# Altium schematic sheet RF_433MHz.SchDoc
size A3
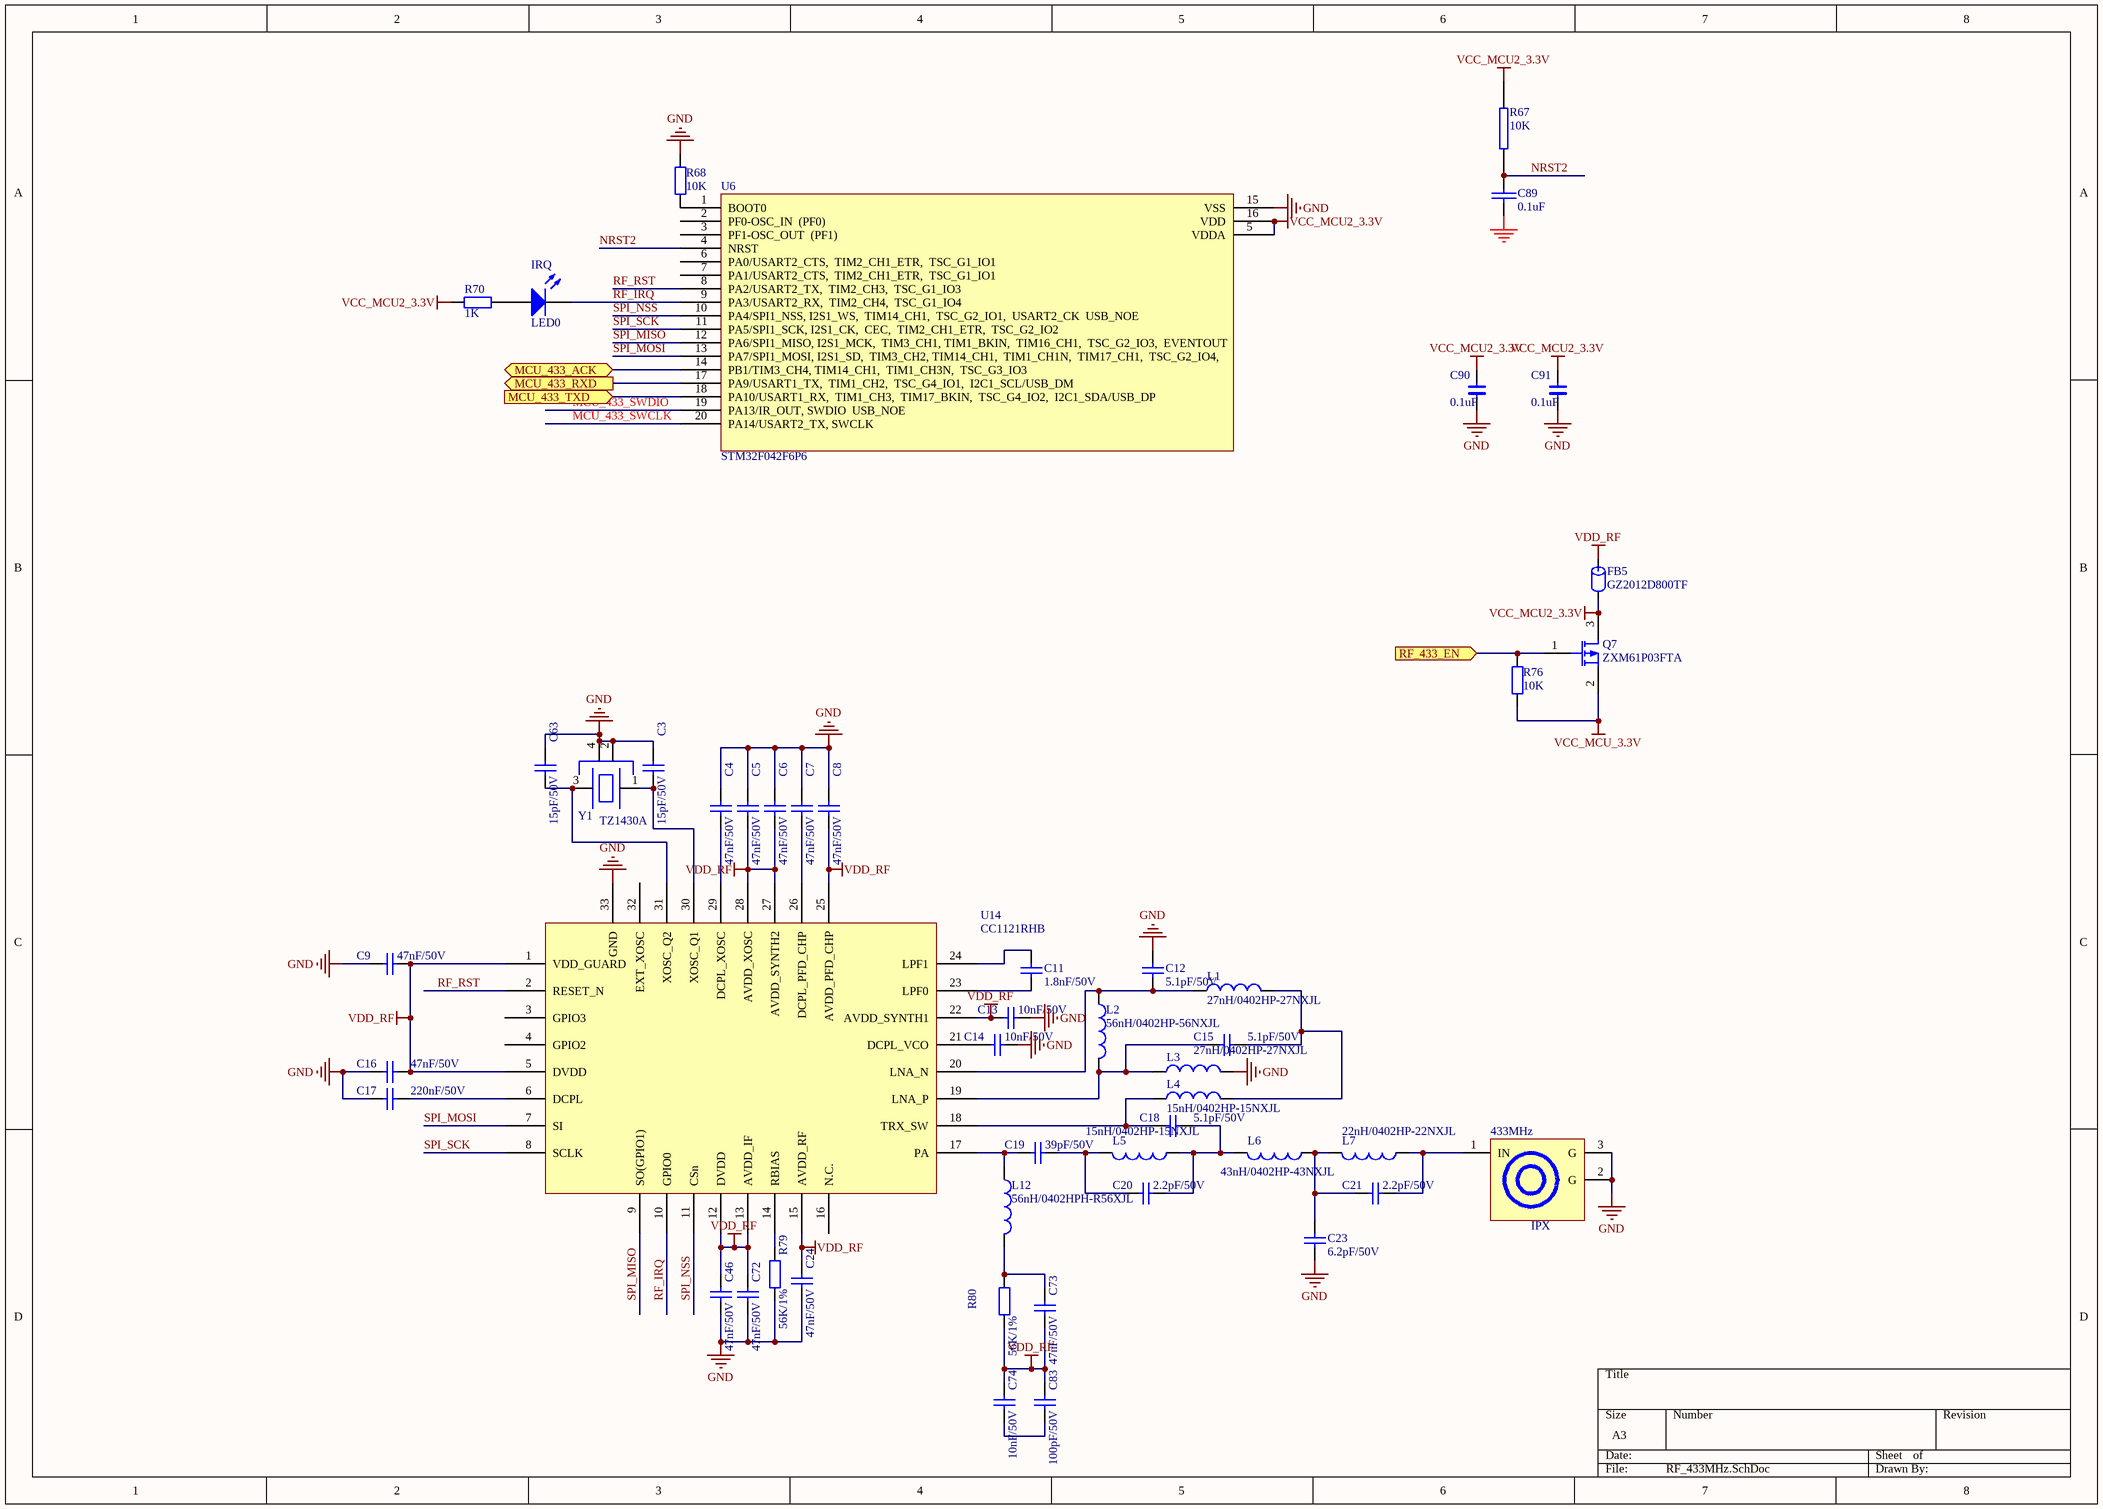
[diagram p0: RF_433MHz.SchDoc]

## Parts
433MHz  IPX  [ECT8180001581]
C3  15pF/50V  [0402C]
C4  47nF/50V  [0402C]
C5  47nF/50V  [0402C]
C6  47nF/50V  [0402C]
C7  47nF/50V  [0402C]
C8  47nF/50V  [0402C]
C9  47nF/50V  [0402C]
C11  1.8nF/50V  [0402C]
C12  5.1pF/50V  [0402C]
C13  10nF/50V  [0402C]
C14  10nF/50V  [0402C]
C15  5.1pF/50V  [0402C]
C16  47nF/50V  [0402C]
C17  220nF/50V  [0402C]
C18  5.1pF/50V  [0402C]
C19  39pF/50V  [0402C]
C20  2.2pF/50V  [0402C]
C21  2.2pF/50V  [0402C]
C23  6.2pF/50V  [0402C]
C24  47nF/50V  [0402C]
C46  47nF/50V  [0402C]
C63  15pF/50V  [0402C]
C72  47nF/50V  [0402C]
C73  47nF/50V  [0402C]
C74  10nF/50V  [0402C]
C83  100pF/50V  [0402C]
C89  0.1uF  [0603C]
C90  0.1uF  [0603C]
C91  0.1uF  [0603C]
FB5  GZ2012D800TF  [0805CZ]
IRQ  LED0  [0603LED]
L1  27nH/0402HP-27NXJL  [0402R]
L2  56nH/0402HP-56NXJL  [0402R]
L3  27nH/0402HP-27NXJL  [0402R]
L4  15nH/0402HP-15NXJL  [0402R]
L5  15nH/0402HP-15NXJL  [0402R]
L6  43nH/0402HP-43NXJL  [0402R]
L7  22nH/0402HP-22NXJL  [0402R]
L12  56nH/0402HPH-R56XJL  [0402R]
Q7  ZXM61P03FTA  [SOT23-3]
R67  10K  [0603R]
R68  10K  [0603R]
R70  1K  [0603R]
R76  10K  [0603R]
R79  56K/1%  [0603R]
R80  56K/1%  [0603R]
U6  STM32F042F6P6  [SOP65P640X265-20N]
U14  CC1121RHB
Y1  TZ1430A  [OSCILLATOR-2.5X2.0]

## Ports
MCU_433_ACK (bidir), MCU_433_RXD (out), MCU_433_TXD (in), RF_433_EN (in)

## Nets
GND: 433MHz.2(G) 433MHz.3(G) C3.2 C4.2 C5.2 C6.2 C7.2 C8.2 C9.1 C12.1 C13.2 C14.2 C16.1 C17.1 C23.1 C24.1 C46.1 C63.2 C72.1 C89.2 C90.1 C91.1 L3.2 R68.2 R79.2 U6.15(VSS) U14.33(GND) Y1.2(GND) Y1.4(GND)
VCC_MCU2_3.3V: C90.2 C91.2 FB5.2 Q7.3(S) R67.1 R70.1 U6.5(VDDA) U6.16(VDD)
VCC_MCU_3.3V: Q7.2(D) R76.2
VDD_RF: C5.1 C6.1 C8.1 C9.2 C13.1 C16.2 C24.2 C46.2 C72.2 C73.1 C74.2 C83.2 FB5.1 R80.2 U14.1(VDD_GUARD) U14.5(DVDD) U14.12(DVDD) U14.13(AVDD_IF) U14.15(AVDD_RF) U14.22(AVDD_SYNTH1) U14.25(AVDD_PFD_CHP) U14.27(AVDD_SYNTH2) U14.28(AVDD_XOSC)
MCU_433_ACK: U6.14(PB1/TIM3_CH4,_TIM14_CH1,__TIM1_CH3N,__TSC_G3_IO3) ; port MCU_433_ACK
MCU_433_RXD: U6.17(PA9/USART1_TX,__TIM1_CH2,__TSC_G4_IO1,__I2C1_SCL/USB_DM) ; port MCU_433_RXD
MCU_433_SWCLK: U6.20(PA14/USART2_TX,_SWCLK)
MCU_433_SWDIO: U6.19(PA13/IR_OUT,_SWDIO__USB_NOE)
MCU_433_TXD: U6.18(PA10/USART1_RX,__TIM1_CH3,__TIM17_BKIN,__TSC_G4_IO2,__I2C1_SDA/USB_DP) ; port MCU_433_TXD
NRST2: C89.1 R67.2 U6.4(NRST)
RF_433_EN: Q7.1(G) R76.1 ; port RF_433_EN
RF_IRQ: IRQ.2(K) U6.9(PA3/USART2_RX,__TIM2_CH4,__TSC_G1_IO4) U14.10(GPIO0)
RF_RST: U6.8(PA2/USART2_TX,__TIM2_CH3,__TSC_G1_IO3) U14.2(RESET_N)
SPI_MISO: U6.12(PA6/SPI1_MISO,_I2S1_MCK,__TIM3_CH1,_TIM1_BKIN,__TIM16_CH1,__TSC_G2_IO3,__EVENTOUT) U14.9(SO(GPIO1))
SPI_MOSI: U6.13(PA7/SPI1_MOSI,_I2S1_SD,__TIM3_CH2,_TIM14_CH1,__TIM1_CH1N,__TIM17_CH1,__TSC_G2_IO4,) U14.7(SI)
SPI_NSS: U6.10(PA4/SPI1_NSS,_I2S1_WS,__TIM14_CH1,__TSC_G2_IO1,__USART2_CK__USB_NOE) U14.11(CSn)
SPI_SCK: U6.11(PA5/SPI1_SCK,_I2S1_CK,__CEC,__TIM2_CH1_ETR,__TSC_G2_IO2) U14.8(SCLK)
Net433MHz_1: 433MHz.1(IN) C21.2 L7.1
NetC3_1: C3.1 U14.30(XOSC_Q1) Y1.1
NetC4_1: C4.1 U14.29(DCPL_XOSC)
NetC7_1: C7.1 U14.26(DCPL_PFD_CHP)
NetC11_1: C11.1 U14.23(LPF0)
NetC11_2: C11.2 U14.24(LPF1)
NetC12_2: C12.2 L1.1 L2.1 U14.20(LNA_N)
NetC14_1: C14.1 U14.21(DCPL_VCO)
NetC15_1: C15.1 L1.2 L4.2
NetC15_2: C15.2 L2.2 L3.1 U14.19(LNA_P)
NetC17_2: C17.2 U14.6(DCPL)
NetC18_1: C18.1 C20.2 L5.1 L6.2
NetC18_2: C18.2 L4.1 U14.18(TRX_SW)
NetC19_1: C19.1 L12.1 U14.17(PA)
NetC19_2: C19.2 C20.1 L5.2
NetC21_1: C21.1 C23.2 L6.1 L7.2
NetC63_1: C63.1 U14.31(XOSC_Q2) Y1.3
NetC73_2: C73.2 L12.2 R80.1
NetC74_1: C74.1 C83.1
NetIRQ_1: IRQ.1(A) R70.2
NetR68_1: R68.1 U6.1(BOOT0)
NetR79_1: R79.1 U14.14(RBIAS)

Not connected (* = marked no-connect by the designer): U6 2(PF0-OSC_IN__(PF0)) 3(PF1-OSC_OUT__(PF1)) 6(PA0/USART2_CTS,__TIM2_CH1_ETR,__TSC_G1_IO1) 7(PA1/USART2_CTS,__TIM2_CH1_ETR,__TSC_G1_IO1); U14 3(GPIO3) 4(GPIO2) 16(N.C.) 32(EXT_XOSC)

## Library data of the parts
433MHz = IPX: MCU; ComponentLink1Description: 供应商链接; ComponentLink1URL: http://www.szlcsc.com/product/details_9202.html; Package: LQFP-44_10x10x08P; Supplier: LC; SuppliersPartNumber: C8696
C3-C9 C11-C21 C23 C24 C46 C63 C72-C74 C83 = Cap: Capacitor SMD; Value: 100nF; Published: 8-Jun-2000; LatestRevisionDate: 05-oct-2007  -  Semtech; LatestRevisionNote: Re-released for DXP Platform.; Publisher: Altium Limited
C89 = CAP: Capacitor
C90 C91 = C
FB5 = FB: Part Field 1: 磁珠/0603/1K ohm/100MHz; FB: BLM18BD102SN1(muRata); Text Field1: FB
IRQ = LED0: Typical INFRARED GaAs LED; Published: 8-Jun-2000; LatestRevisionDate: 08-Jul-2005; LatestRevisionNote: Mech Layer 1 removed.; PackageReference: LED-0; Publisher: Altium Limited
L1-L7 L12 = Inductor: Inductor SMD; Code_IEC: 1005; Value: VAL?; Published: 8-Jun-2000; LatestRevisionDate: 05-oct-2007  -  Semtech; LatestRevisionNote: Re-released for DXP Platform.; Publisher: Altium Limited; Code_JEITA: 0402
Q7 = MOSFET-P: ZXM61P03F; Published: 8-Jun-2000; LatestRevisionDate: 17-Jul-2002; LatestRevisionNote: Re-released for DXP Platform.; PackageVersion: 1995/1996; PackageReference: E3; Publisher: Altium Limited
R67 = RES2
R68 R70 = Res2: Resistor; Published: 8-Jun-2000; LatestRevisionDate: 17-Jul-2002; LatestRevisionNote: Re-released for DXP Platform.; PackageReference: AXIAL-0.4; Publisher: Altium Limited
  R68: Value: 10K
  R70: Value: 1K
R76 R79 R80 = Res2: Resistor; Value: 1K; Published: 8-Jun-2000; LatestRevisionDate: 17-Jul-2002; LatestRevisionNote: Re-released for DXP Platform.; PackageReference: AXIAL-0.4; Publisher: Altium Limited
Y1 = XTAL3